# EAGLE schematic usain_bot_chasis (EAGLE 9.4.2)
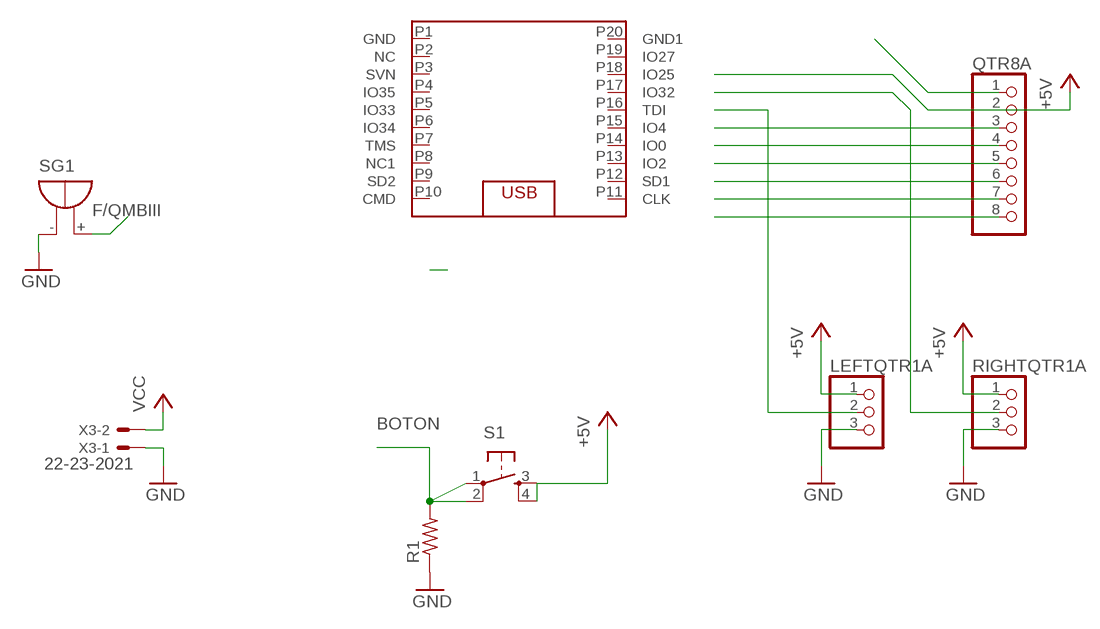
[diagram p0: schematic, sheet 1]

## Parts
ESP32  ESP32_MINI_KIT  [ESP32_MINI_KIT]
LEFTQTR1A  PINHD-1X3  [1X03]
QTR8A  PINHD-1X8BIG  [1X08-BIG]
R1  R-US_0207/7  [0207/7]
RIGHTQTR1A  PINHD-1X3  [1X03]
S1  TAC_SWITCHPTH  [TACTILE-PTH]
SG1  F/QMBIII  [F/QMBIII]
X3  22-23-2021  [22-23-2021]

## Nets
+5V: LEFTQTR1A.1 QTR8A.2 RIGHTQTR1A.1 S1.3 S1.4
BOTON: R1.2 S1.1 S1.2
GND: LEFTQTR1A.3 R1.1 RIGHTQTR1A.3 SG1.-(+) X3.1
N$1: QTR8A.8
N$2: QTR8A.7
N$3: QTR8A.6
N$4: QTR8A.5
N$5: QTR8A.4
N$6: QTR8A.3
N$7: QTR8A.1
N$21: SG1.+(-)
N$22: LEFTQTR1A.2
N$23: RIGHTQTR1A.2
VCC: X3.2
Unconnected: ESP32.P1(GND) ESP32.P2(NC) ESP32.P3(SVN) ESP32.P4(IO35) ESP32.P5(IO33) ESP32.P6(IO34) ESP32.P7(TMS) ESP32.P8(NC1) ESP32.P9(SD2) ESP32.P10(CMD) ESP32.P11(CLK) ESP32.P12(SD1) ESP32.P13(IO2) ESP32.P14(IO0) ESP32.P15(IO4) ESP32.P16(TDI) ESP32.P17(IO32) ESP32.P18(IO25) ESP32.P19(IO27) ESP32.P20(GND1)

## Library data of the parts
ESP32 = robot-hand:ESP32_MINI_KIT
LEFTQTR1A RIGHTQTR1A = adafruit:PINHD-1X3: PIN HEADER
QTR8A = adafruit:PINHD-1X8: PIN HEADER
R1 = resistor:R-US_: RESISTOR, American symbol
S1 = SparkFun-Retired:TAC_SWITCH: Momentary Switch Button commonly used for reset or general input. Spark Fun Electronics SKU : COM-00097 SMT- SWCH-08247
SG1 = buzzer:F/QMBIII: BUZZER Source: Buerklin; OC_FARNELL: unknown; OC_NEWARK: unknown
X3 = con-molex:22-23-2021: .100" (2.54mm) Center Header - 2 Pin; MF: MOLEX; MPN: 22-23-2021; OC_FARNELL: 1462926; OC_NEWARK: 25C3832